# Altium project PCB_Project1.PrjPCB
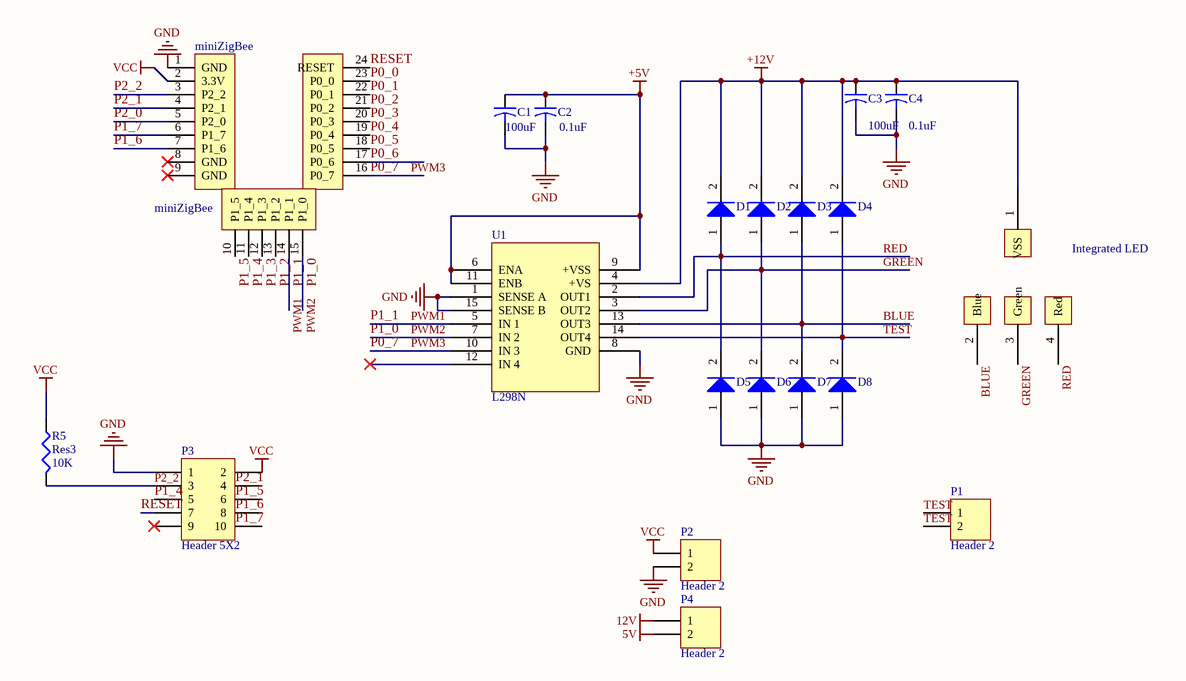
[diagram p0: Integrated LED.SCHDOC]
1 sheet, 20 parts. Net scope: global (net labels, ports and power ports of the same name join across sheets).
Board files: Integrated LED.PcbDoc, Integrated LED Rectangle.PcbDoc

## Sheet Integrated LED.SCHDOC
size A4

### Parts
C1  value 100uF  [PCBComponent_1]
C2  value 0.1uF  [PCBComponent_1]
C3  value 100uF  [PCBComponent_1]
C4  value 0.1uF  [PCBComponent_1]
D1  IN4007  [IN4007]  (value not drawn)
D2  IN4007  [IN4007]  (value not drawn)
D3  IN4007  [IN4007]  (value not drawn)
D4  IN4007  [IN4007]  (value not drawn)
D5  IN4007  [IN4007]  (value not drawn)
D6  IN4007  [IN4007]  (value not drawn)
D7  IN4007  [IN4007]  (value not drawn)
D8  IN4007  [IN4007]  (value not drawn)
Integrated_LED  Integrated LED  [Integrated LED]  (value not drawn)
miniZigBee  miniZigBee  [miniZigBee]
P1  Header 2  [HDR1X2]
P2  Header 2  [HDR1X2]
P3  Header 5X2  [HDR2X5]
P4  Header 2  [HDR1X2]
R5  Res3  value 10K  [J1-0603]
U1  L298N  [L298N - duplicate]

### Nets
5V: P4.2
12V: P4.1
+5V: C1.1 C2.1 U1.6(ENA) U1.9(+VSS) U1.11(ENB)
+12V: C3.1 C4.1 D1.2(K) D2.2(K) D3.2(K) D4.2(K) Integrated_LED.1(VSS) U1.4(+VS)
GND: C1.2 C2.2 C3.2 C4.2 D5.1(A) D6.1(A) D7.1(A) D8.1(A) miniZigBee.1(GND) P2.2 P3.1 U1.1(SENSE_A) U1.8(GND) U1.15(SENSE_B)
VCC: miniZigBee.2(3.3V) P2.1 P3.2 R5.1
BLUE: D3.1(A) D7.2(K) Integrated_LED.2(Blue) U1.13(OUT3)
GREEN: D2.1(A) D6.2(K) Integrated_LED.3(Green) U1.3(OUT2)
P0_0: miniZigBee.23(P0_0)
P0_1: miniZigBee.22(P0_1)
P0_2: miniZigBee.21(P0_2)
P0_3: miniZigBee.20(P0_3)
P0_4: miniZigBee.19(P0_4)
P0_5: miniZigBee.18(P0_5)
P0_6: miniZigBee.17(P0_6)
P0_7: miniZigBee.16(P0_7) U1.10(IN_3)  [also labelled PWM3]
P1_0: miniZigBee.15(P1_0) U1.7(IN_2)  [also labelled PWM2]
P1_1: miniZigBee.14(P1_1) U1.5(IN_1)  [also labelled PWM1]
P1_2: miniZigBee.13(P1_2)
P1_3: miniZigBee.12(P1_3)
P1_4: miniZigBee.11(P1_4) P3.5
P1_5: miniZigBee.10(P1_5)
P1_6: miniZigBee.7(P1_6)
P1_7: miniZigBee.6(P1_7)
P2_0: miniZigBee.5(P2_0)
P2_1: miniZigBee.4(P2_1)
P2_2: miniZigBee.3(P2_2) P3.3 R5.2
RED: D1.1(A) D5.2(K) Integrated_LED.4(Red) U1.2(OUT1)
RESET: miniZigBee.24(RESET) P3.7
TEST: D4.1(A) D8.2(K) P1.1 P1.2 U1.14(OUT4)

Not connected (* = marked no-connect by the designer): miniZigBee 8(GND)* 9(GND)*; P3 4 6 8 9* 10; U1 12(IN_4)*

### Notes on the sheet
- Labels drawn without touching a wire or pin: P1_5, P1_6, P1_7, P2_1

### Library data of the parts
C1-C4 = Cap2: Capacitor; Published: 23-Sep-2002; PackageReference: CAPR5-4X5; Publisher: Altium Limited
P1 P2 P4 = Header 2: Header, 2-Pin; LatestRevisionDate: 17-Jul-2002; LatestRevisionNote: Re-released for DXP Platform.; Publisher: Altium Limited
P3 = Header 5X2: Header, 5-Pin, Dual row; LatestRevisionDate: 17-Jul-2002; LatestRevisionNote: Re-released for DXP Platform.; Publisher: Altium Limited
R5 = Res3: Resistor; Published: 8-Jun-2000; LatestRevisionDate: 29-May-2009; LatestRevisionNote: IPC-7351 Footprint Added.; PackageReference: J1-0603; Publisher: Altium Limited; PackageDescription: Chip Resistor